# EAGLE design SimpleSimon (EAGLE 9.5.2)
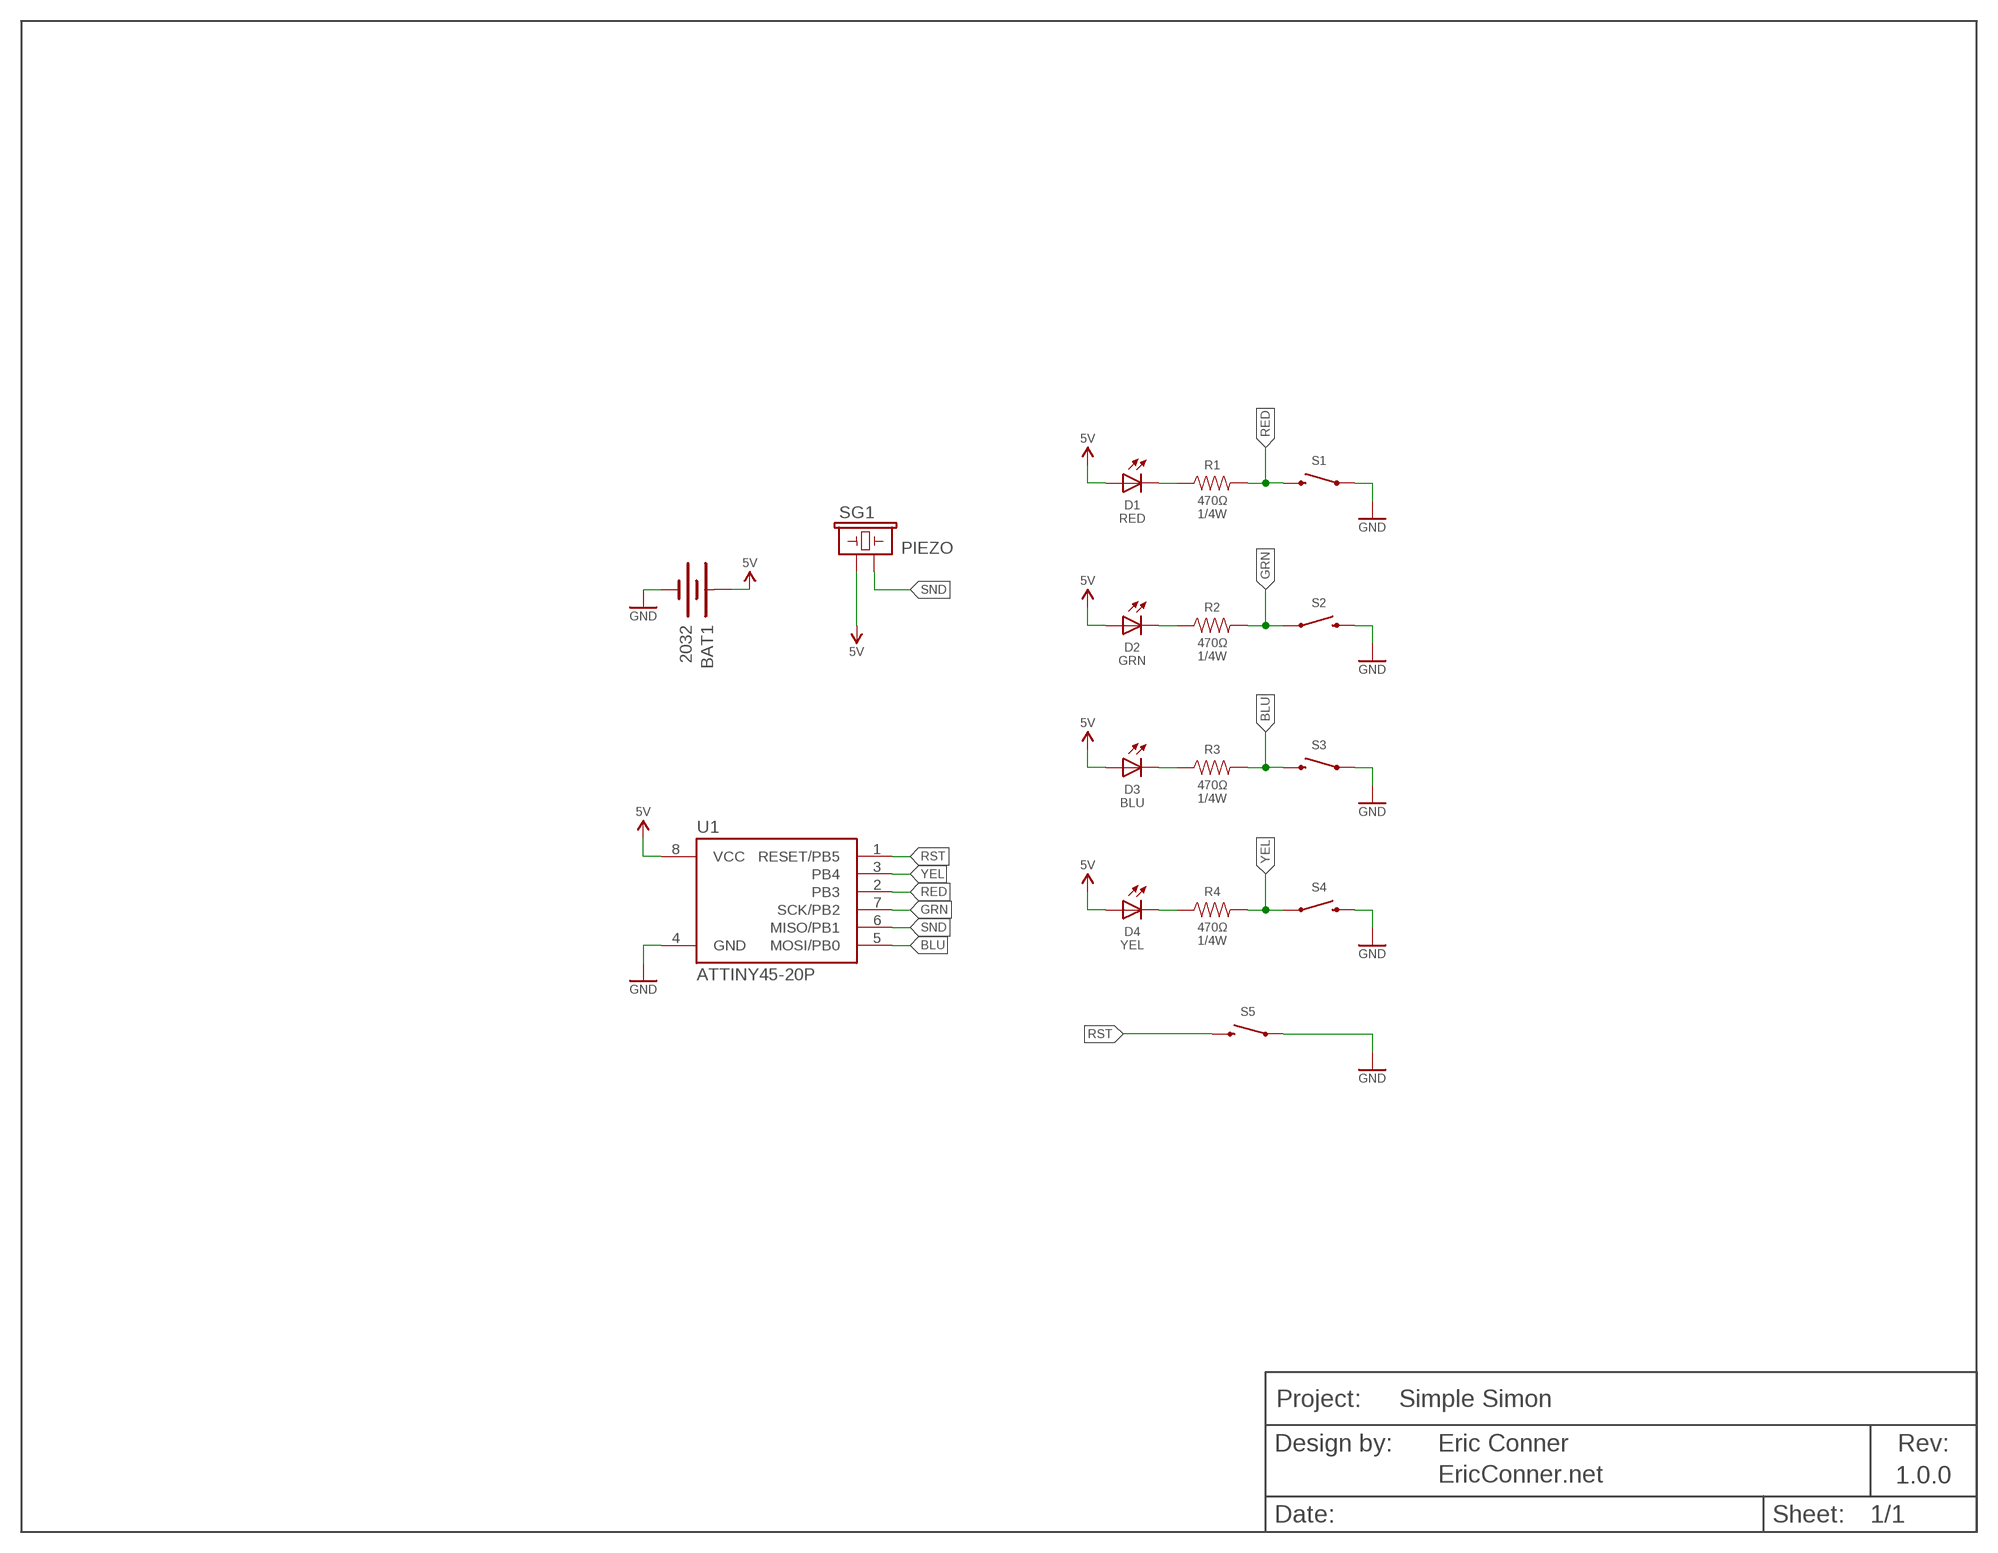
[diagram p0: schematic, sheet 1]

## Parts
BAT1  2032  BATTERY2032  [BAT-2032]
BORDER1  BORDER_LETTER-MINIMAL  [MINIMAL_LOGO]
D1  RED  LED5MM  [LED5MM]
D2  GRN  LED5MM  [LED5MM]
D3  BLU  LED5MM  [LED5MM]
D4  YEL  LED5MM  [LED5MM]
R1  470Ω  RESISTOR1/4W  [1/4R]
R2  470Ω  RESISTOR1/4W  [1/4R]
R3  470Ω  RESISTOR1/4W  [1/4R]
R4  470Ω  RESISTOR1/4W  [1/4R]
S1  SWITCH-MOMENTARY-2PTH  [TACTILE-PTH]
S2  SWITCH-MOMENTARY-2PTH  [TACTILE-PTH]
S3  SWITCH-MOMENTARY-2PTH  [TACTILE-PTH]
S4  SWITCH-MOMENTARY-2PTH  [TACTILE-PTH]
S5  SWITCH-MOMENTARY-2PTH  [TACTILE-PTH]
SG1  PIEZO  BUZZERPTH  [BUZZER-12MM]
U1  ATTINY45-20P  [PDIP08_300MIL]

## Nets
BLU: R3.P$2 S3.3 U1.5(MOSI/PB0)
GND: BAT1.- S1.1 S2.3 S3.1 S4.3 S5.1 U1.4(GND)
GRN: R2.P$2 S2.1 U1.7(SCK/PB2)
N$1: D1.K(C) R1.P$1
N$2: D2.K(C) R2.P$1
N$3: D3.K(C) R3.P$1
N$4: D4.K(C) R4.P$1
RED: R1.P$2 S1.3 U1.2(PB3)
RST: S5.3 U1.1(RESET/PB5)
SND: SG1.- U1.6(MISO/PB1)
VCC: BAT1.+ D1.A D2.A D3.A D4.A SG1.+ U1.8(VCC) ; supply symbol labelled 5V
YEL: R4.P$2 S4.1 U1.3(PB4)

## Library data of the parts
BAT1 = ECA_Electromechanical:BATTERY; DIGIKEY: BS-7-ND
BORDER1 = ECA-Aesthetics:BORDER_LETTER: 8.5x11 Schematic Border; DESIGNER: Eric Conner; PROJECT: Simple Simon; VERSION: 1.0.0; WEBSITE: EricConner.net; YEAR: 2019
D1 = SparkFun-LED:LED: LEDs Standard schematic elements and footprints for 5mm, 3mm, 1206, and 0603 sized LEDs. 5mm - Spark Fun Electronics SKU : COM-00529 (and others); DIGIKEY: 160-1678-ND
D2 = SparkFun-LED:LED: LEDs Standard schematic elements and footprints for 5mm, 3mm, 1206, and 0603 sized LEDs. 5mm - Spark Fun Electronics SKU : COM-00529 (and others); DIGIKEY: 160-1677-ND
D3 = SparkFun-LED:LED: LEDs Standard schematic elements and footprints for 5mm, 3mm, 1206, and 0603 sized LEDs. 5mm - Spark Fun Electronics SKU : COM-00529 (and others); DIGIKEY: 160-1610-ND
D4 = SparkFun-LED:LED: LEDs Standard schematic elements and footprints for 5mm, 3mm, 1206, and 0603 sized LEDs. 5mm - Spark Fun Electronics SKU : COM-00529 (and others); DIGIKEY: 160-1686-ND
R1-R4 = WV Arcade:RESISTOR: Generic Resistor; ATTRIBUTE: 1/4W; DIGIKEY: CF14JT470RCT-ND
S1-S5 = SparkFun-Electromechanical:SWITCH-MOMENTARY-2: Various NO switches- pushbuttons, reed, etc; DIGIKEY: 450-1644-ND
SG1 = SparkFun-Electromechanical:BUZZER: Buzzer 12mm Spark Fun Electronics SKU : Comp-Buzzer; DIGIKEY: 102-3752-ND
U1 = ATtiny:ATTINY45*: ATMEL ATtiny 45 Technologies Note: for complete ordering code (temp. range, finish, tape&reel etc.) see www.atmel.com • Supply Voltage: V = (1.8…5.5)V | [blank] = (2.7…5.5)V • Speed: 10 = 10 MHz | 20 = 20 MHz Author: Eric Conner; DIGIKEY: ATTINY45-20PU-ND

## Net classes
0 default: clearance 0.61 mm

## Board
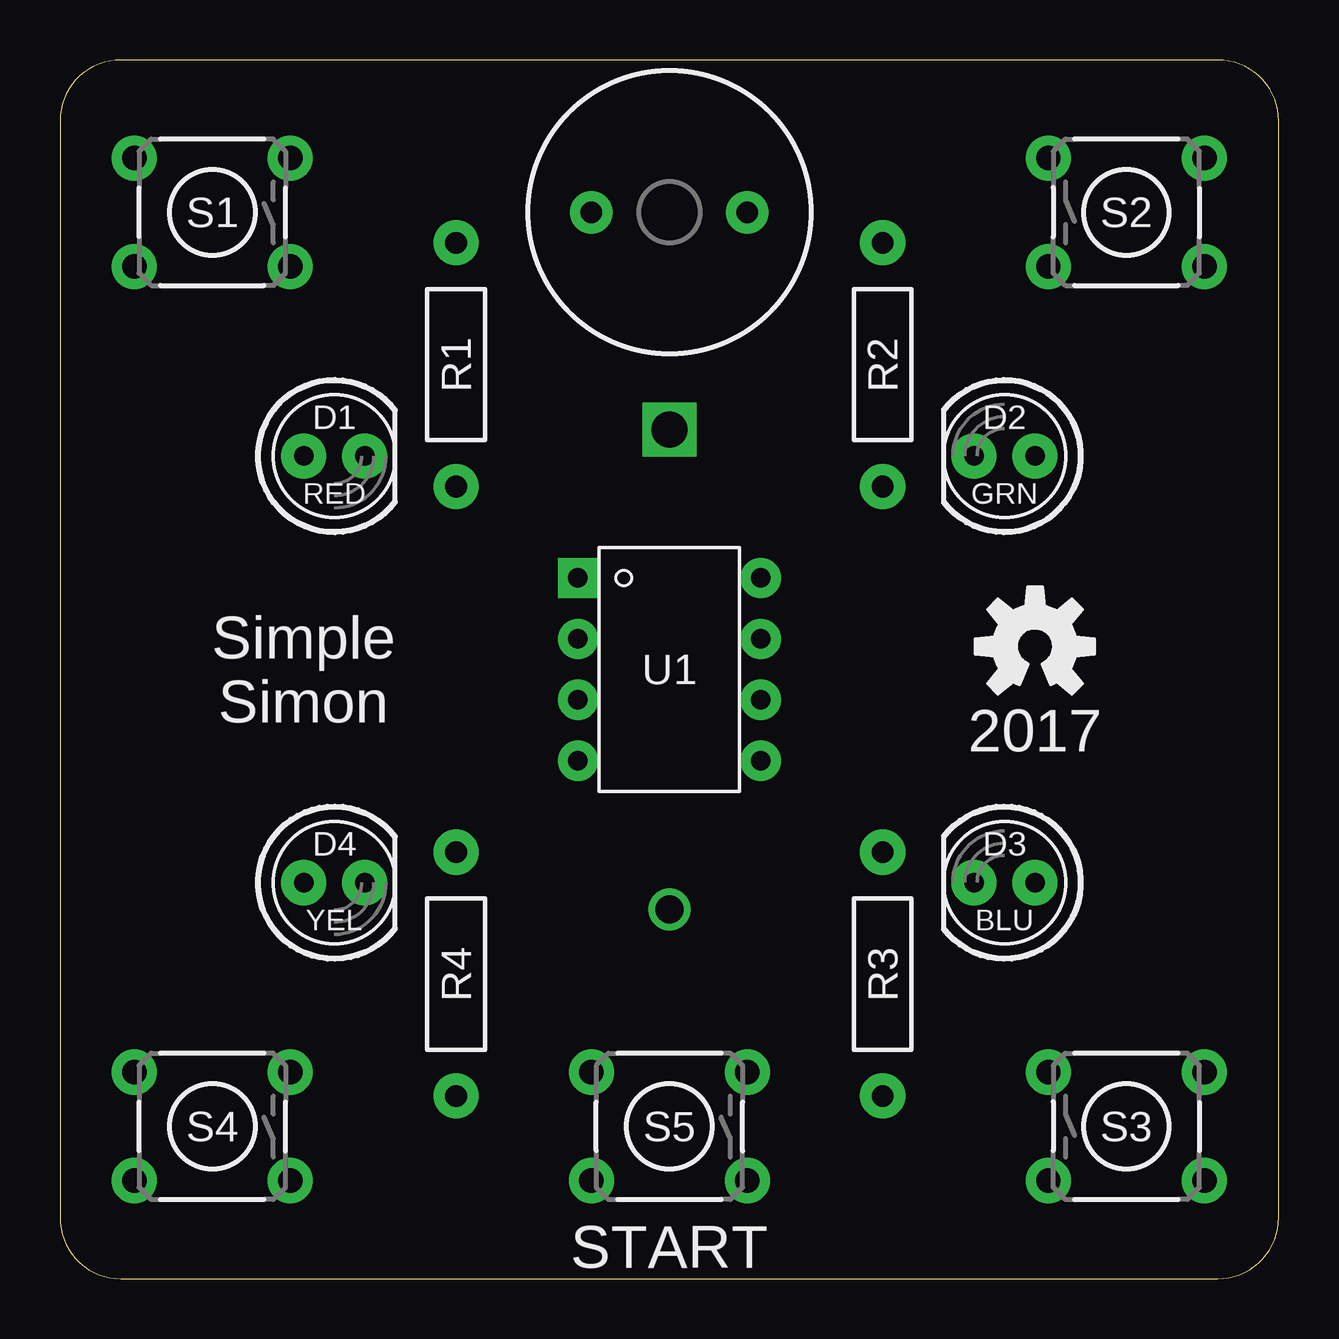
[diagram p1: board, top side]
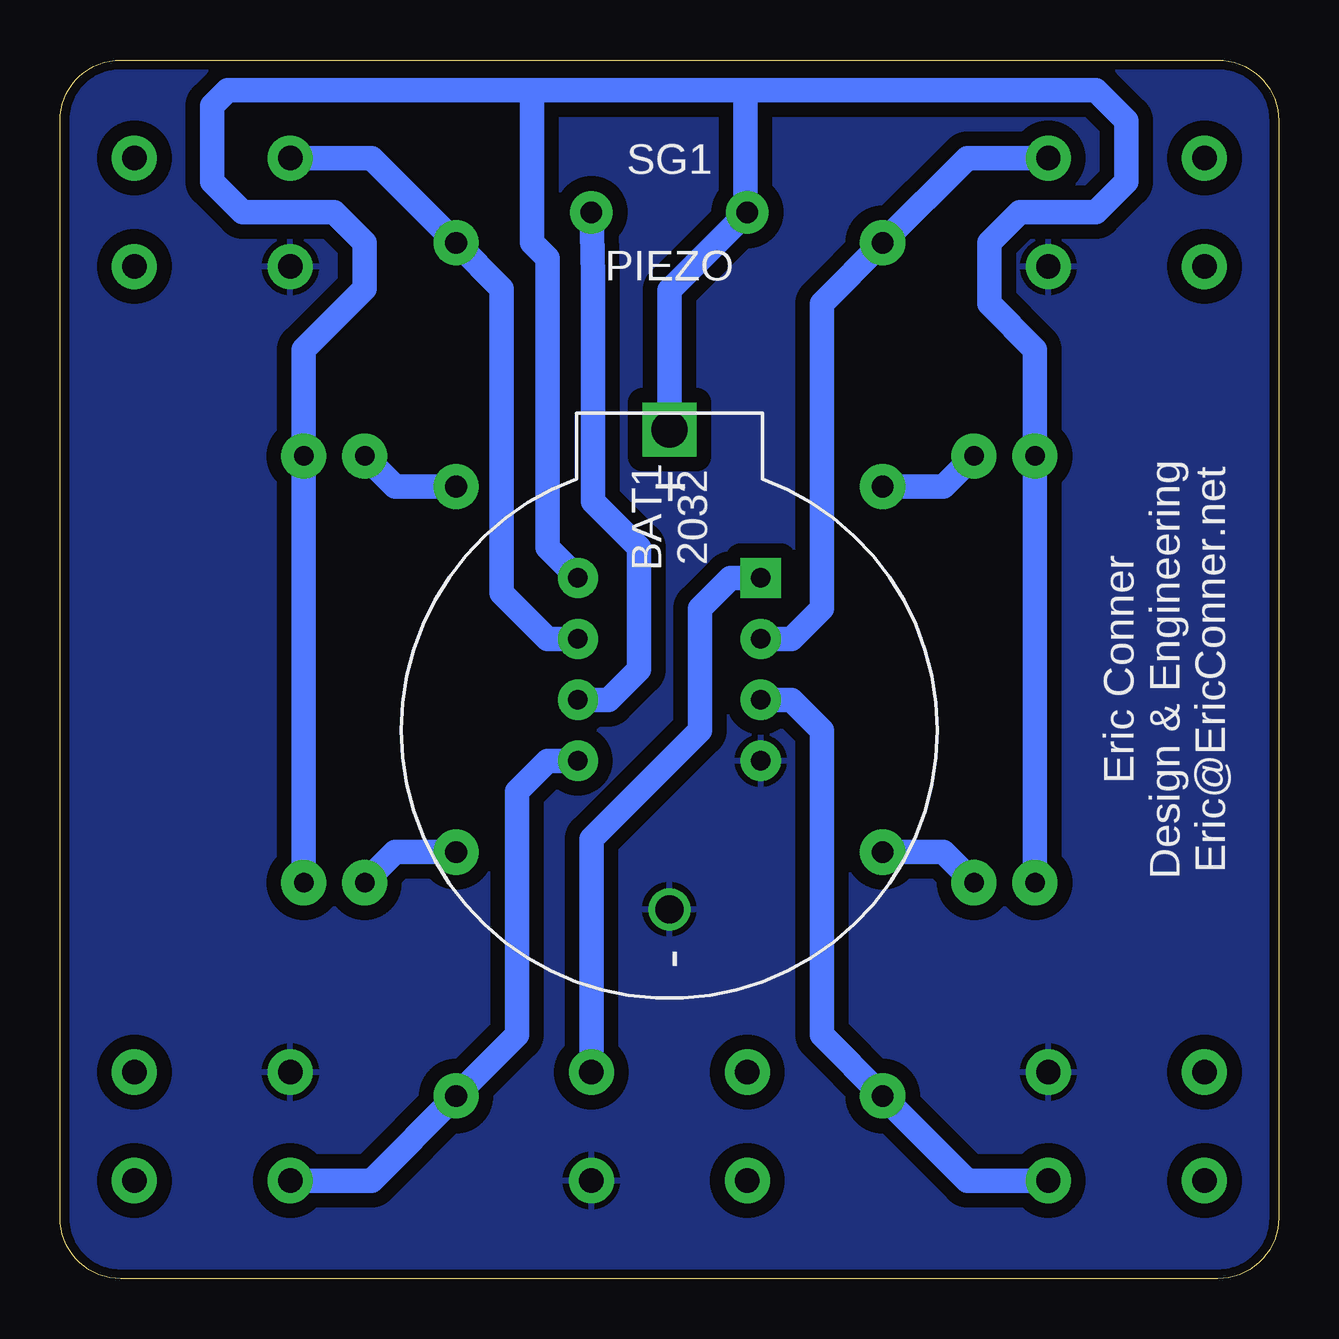
[diagram p2: board, bottom side, seen from below]

Size 50.8 x 50.8 mm. Coordinates in mm from the lower left corner, seen from the top.
Outline: 0,2.54 arc90 2.54,0 48.26,0 arc90 50.8,2.54 50.8,48.26 arc90 48.26,50.8 2.54,50.8 arc90 0,48.26 0,2.54
Copper layers (1*16): Top 0.0356mm / dielectric 1.5011mm / Bottom 0.0356mm
Design rules "LaenPCBOrder": minimum track width 6mil, minimum drill 13mil, track to track 6mil, track to pad 6mil, pad to pad 6mil, via to via 6mil, smd to smd 6mil, copper to edge 15mil, drill to drill 6mil, minimum pad ring 7mil, minimum via ring 7mil, stop-mask expansion 4mil, vias tented up to drill 0mil, thermal gap 10mil

### Footprints (pad centres in the part's own frame; a part is rotated, then mirrored left to right if it is on the bottom)
BAT-2032 = drill 1.5 square: + 12.53,0 | drill 1.17: - -7.46,0
LED5MM = drill 0.813 pad 1.88: A -1.27,0; K 1.27,0
1/4R = drill 0.9 pad 1.88: P$1 0,0; P$2 10.16,0
TACTILE-PTH = drill 1.016 pad 1.88: 1 -3.251,2.261; 2 3.251,2.261; 3 -3.251,-2.261; 4 3.251,-2.261
BUZZER-12MM = drill 0.9 pad 1.778: + 3.25,0; - -3.25,0
PDIP08_300MIL = drill 0.813 pad 1.676 square: 1 -3.81,-3.81 | drill 0.813 pad 1.676: 2 -1.27,-3.81; 3 1.27,-3.81; 4 3.81,-3.81; 5 3.81,3.81; 6 1.27,3.81; 7 -1.27,3.81; 8 -3.81,3.81

### Placement (x,y rotation side)
BAT1  25.4,22.86 90 bottom
BORDER1  2.54,-3.17 0 top  (outside the outline)
D1  11.43,34.29 0 top
D2  39.37,34.29 180 top
D3  39.37,16.51 180 top
D4  11.43,16.51 0 top
R1  16.51,33.02 90 top
R2  34.29,33.02 90 top
R3  34.29,17.78 270 top
R4  16.51,17.78 270 top
S1  6.35,44.45 180 top
S2  44.45,44.45 0 top
S3  44.45,6.35 0 top
S4  6.35,6.35 180 top
S5  25.4,6.35 180 top
SG1  25.4,44.45 180 top
U1  25.4,25.4 270 top
U$1  [OSHW-LOGO-M]  40.64,26.35 0 top

### Tracks (layer width: path | path; a pad name or v marks a point on that pad's centre or on a via)
BLU
  Bottom 1.016: U1.5 30.48,21.59 31.75,20.32 31.75,10.16 R3.P$2 37.82,4.09 S3.3
GND
  pour Bottom: 1.27,52.07 49.53,52.07 52.07,49.53 52.07,1.27 49.53,-1.27 1.27,-1.27 -1.27,1.27 -1.27,49.53
GRN
  Bottom 1.016: U1.7 30.48,26.67 32.38,28.57 32.38,41.27 R2.P$2 37.82,46.71 S2.1
N$1
  Bottom 1.016: R1.P$1 13.97,33.02 D1.K
N$2
  Bottom 1.016: R2.P$1 36.83,33.02 D2.K
N$3
  Bottom 1.016: R3.P$1 36.83,17.78 D3.K
N$4
  Bottom 1.016: R4.P$1 13.97,17.78 D4.K
RED
  Bottom 1.016: U1.2 20.32,26.67 19.05,27.94 19.05,40.64 R1.P$2 12.98,46.71 S1.3
RST
  Bottom 1.016: U1.1 22.86,29.21 24.13,27.94 24.13,22.86 28.65,18.34 S5.3
SND
  Bottom 1.016: U1.6 27.94,24.13 26.67,25.4 26.67,30.48 28.57,32.38 28.57,41.84 SG1.-
VCC
  Bottom 1.016: BAT1.+ 25.4,41.2 SG1.+ | U1.8 30.48,30.48 30.48,42.55 31.11,43.18 31.11,49.53 | 31.11,49.53 22.23,49.53 | 22.23,49.53 22.23,44.52 | D3.A D2.A 40.64,38.73 38.1,41.27 38.1,43.18 39.37,44.45 43.18,44.45 44.45,45.72 44.45,48.9 43.81,49.53 31.11,49.53 | D4.A D1.A 10.16,38.73 12.06,40.64 12.06,43.18 10.79,44.45 7.62,44.45 6.35,45.72 6.35,48.26 7.62,49.53 22.23,49.53
  Bottom 1.27: 22.23,44.52 SG1.+
YEL
  Bottom 1.016: U1.3 20.32,24.13 19.05,22.86 19.05,10.16 R4.P$2 12.98,4.09 S4.1

### Text on the board
tPlace: Simple / Simon | 2017 | START
bPlace: Eric Conner / Design & Engineering / Eric@EricConner.net